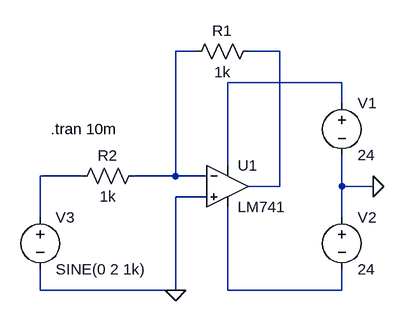
[diagram p0: schematic 7-inv.asc]
7-inv.asc, the LTspice schematic file:
Version 4.1
SHEET 1 880 680
WIRE 144 -64 112 -64
WIRE 272 -64 224 -64
WIRE 368 -16 192 -16
WIRE 368 16 368 -16
WIRE 192 112 192 -16
WIRE -32 128 -96 128
WIRE 112 128 112 -64
WIRE 112 128 48 128
WIRE 160 128 112 128
WIRE 272 144 272 -64
WIRE 272 144 224 144
WIRE 368 144 368 96
WIRE 416 144 368 144
WIRE 160 160 112 160
WIRE -96 192 -96 128
WIRE 368 192 368 144
WIRE -96 304 -96 272
WIRE 112 304 -96 304
WIRE 112 304 112 160
WIRE 192 304 192 176
WIRE 368 304 368 272
WIRE 368 304 192 304
FLAG 416 144 0
FLAG 112 304 0
SYMBOL LM741 192 80 R0
SYMATTR InstName U1
SYMBOL voltage 368 0 R0
SYMATTR InstName V1
SYMATTR Value 24
SYMBOL voltage 368 176 R0
SYMATTR InstName V2
SYMATTR Value 24
SYMBOL voltage -96 176 R0
WINDOW 123 0 0 Left 0
WINDOW 39 0 0 Left 0
SYMATTR InstName V3
SYMATTR Value SINE(0 2 1k)
SYMBOL res 240 -80 R90
WINDOW 0 0 56 VBottom 2
WINDOW 3 32 56 VTop 2
SYMATTR InstName R1
SYMATTR Value 1k
SYMBOL res 64 112 R90
WINDOW 0 0 56 VBottom 2
WINDOW 3 32 56 VTop 2
SYMATTR InstName R2
SYMATTR Value 1k
TEXT -80 56 Left 2 !.tran 10m

The netlist it stands for:
* 7-inv.asc
X§U1 0 N001 N003 N005 N002 LM741  ; pins In+ In- V+ V- OUT
V1 N003 0 24
V2 0 N005 24
V3 N004 0 SINE(0 2 1k)
R1 N002 N001 1k
R2 N001 N004 1k
.tran 10m
.lib LM741.lib
.backanno
.end